# Altium project PC.PrjPCB
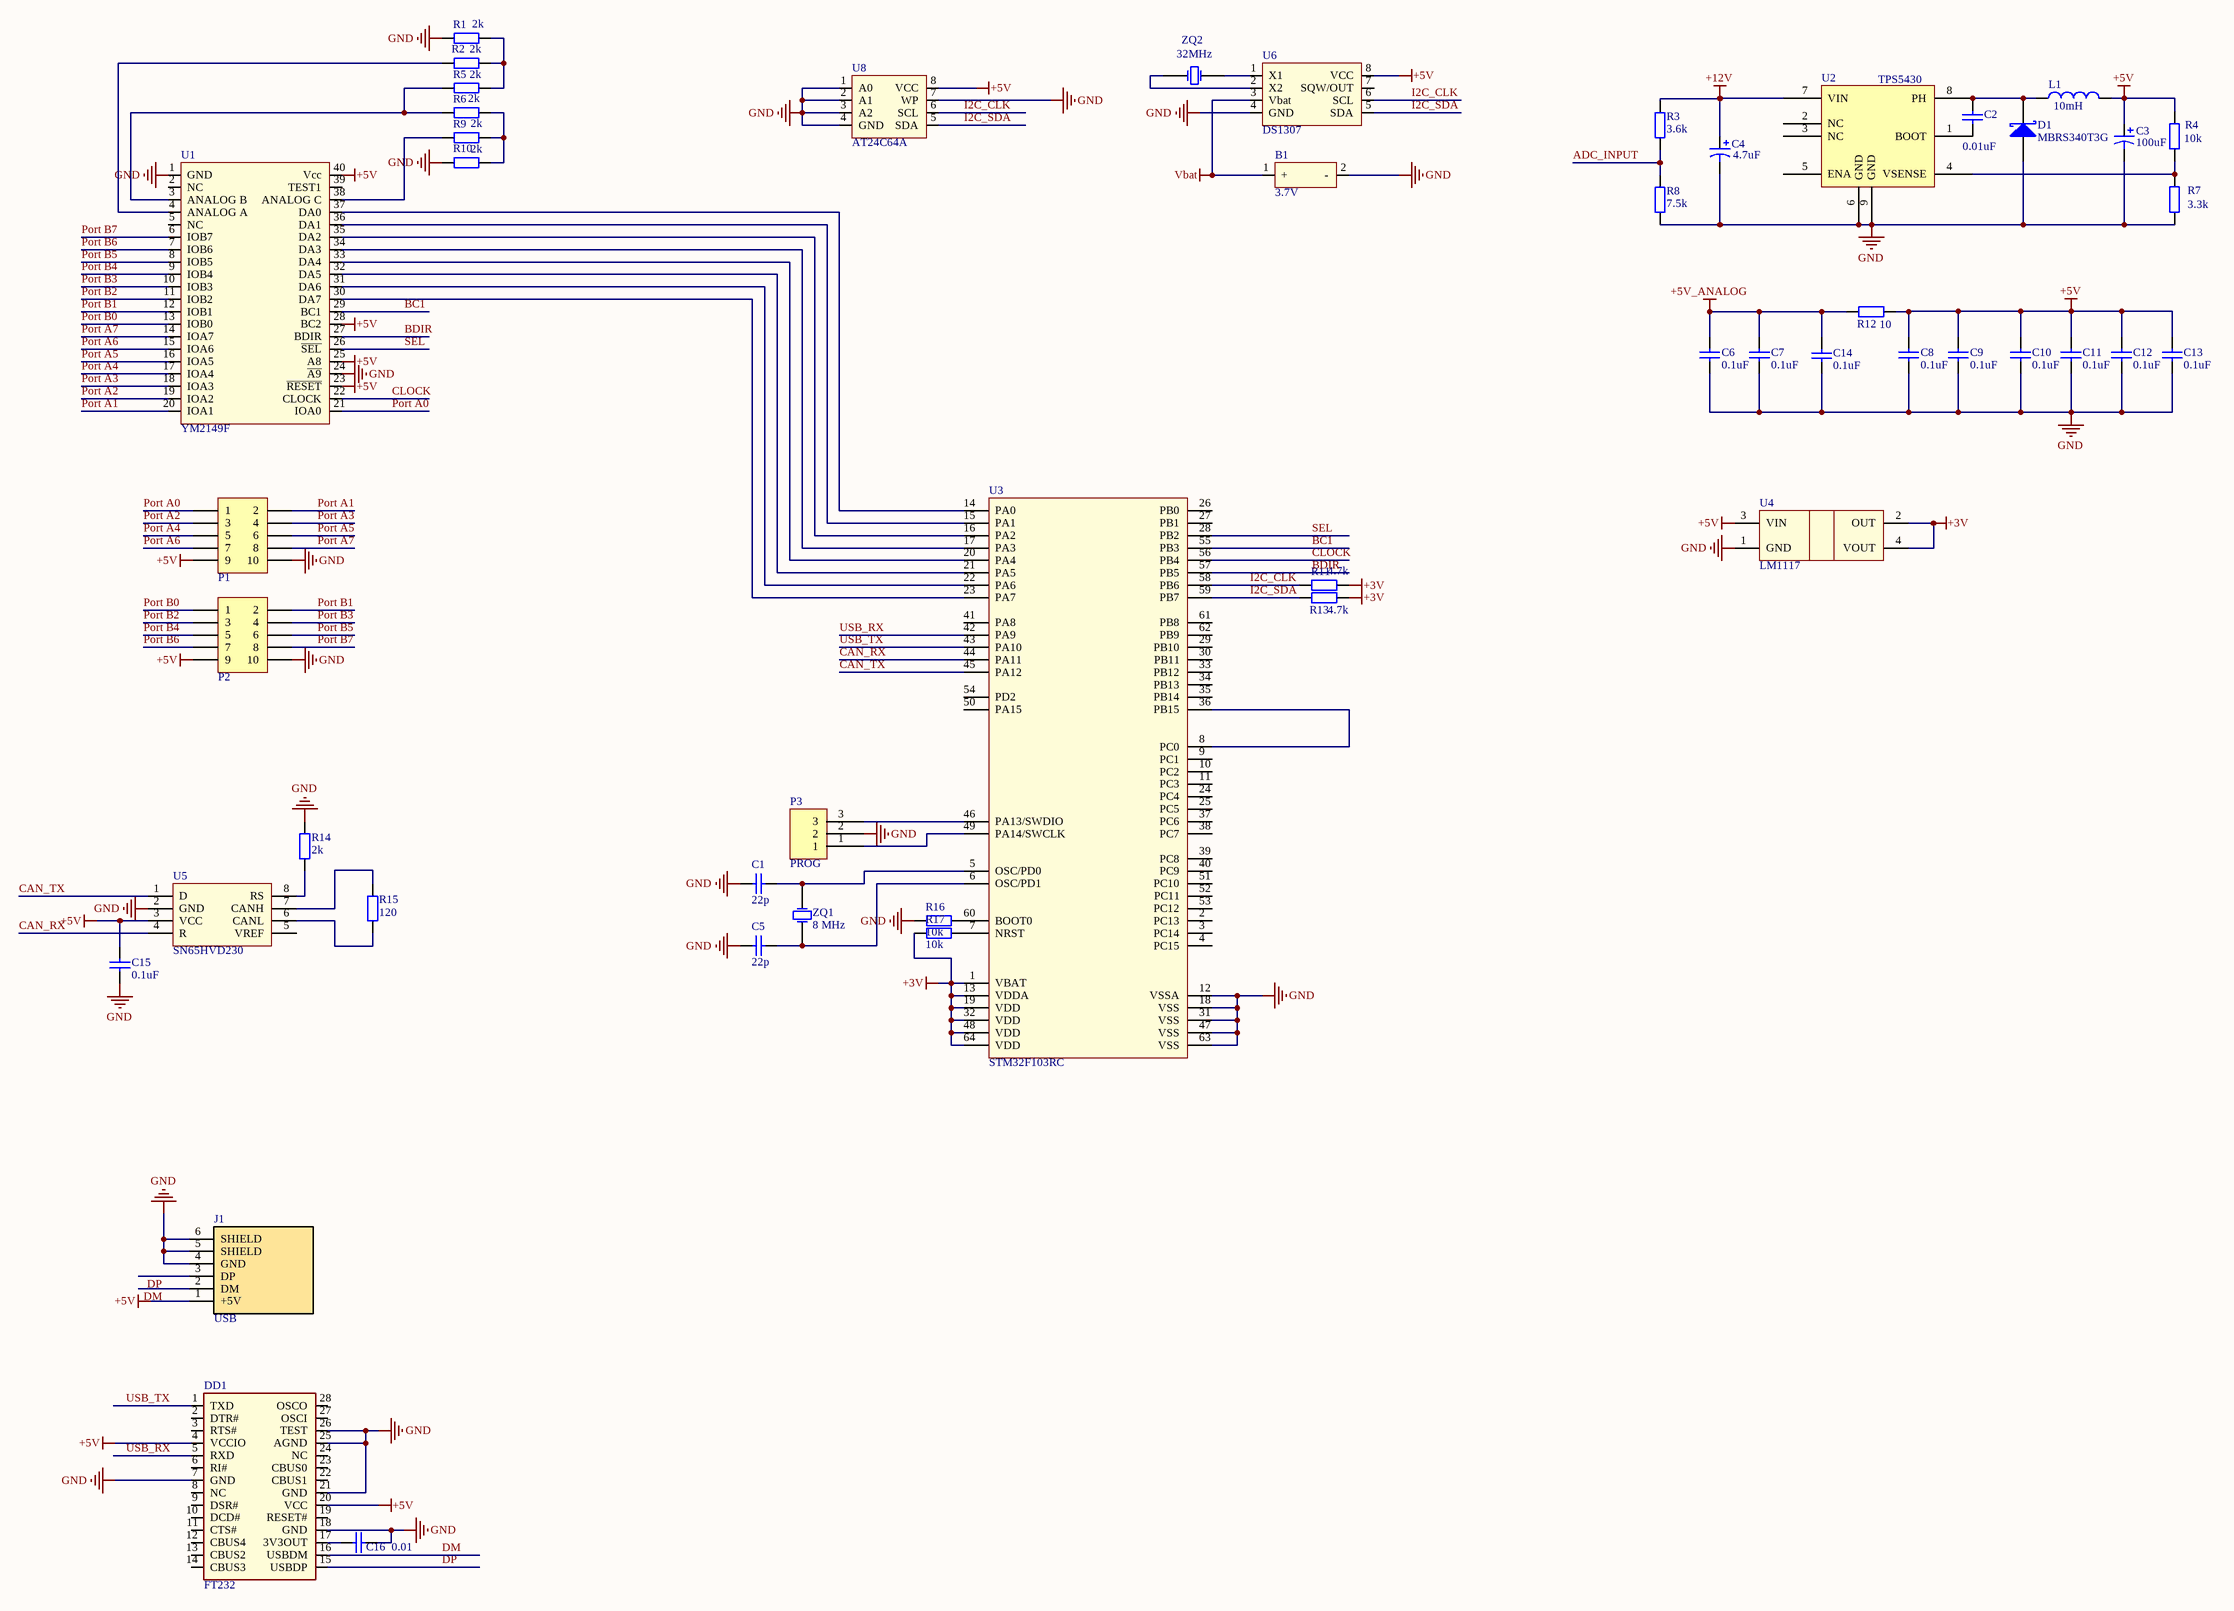
[diagram p0: PC.SchDoc]
1 sheet, 50 parts. Net scope: global (net labels, ports and power ports of the same name join across sheets).
Board file: PC.PcbDoc

## Sheet PC.SchDoc
size A2; PageSetup: Record=PageOptions|CenterHorizontal=True|CenterVertical=True|PrintScale=0.73|XCorrection=1.00|YCorrection=1.00|PrintKind=1|BorderSize=5000000|LeftOffset=0|BottomOffset=0|Orientation=1|PaperLength=1000|PaperWidth=1000|Scale=100|PaperSource=7|PrintQuality=-3|MediaType=1|DitherType=10|PrintScaleMode=1|PaperKind=A4|PaperIndex=9

### Parts
B1  3.7V  [Battery]
C1  value 22p  [Capacitor 0603]  (hidden comment: Capacitor)
C2  0.01uF  [CAP 0805]
C3  100uF  [Capacitor D case]
C4  4.7uF  [Capacitor D case]
C5  value 22p  [Capacitor 0603]  (hidden comment: Capacitor)
C6  0.1uF  [CAP 0805]
C7  0.1uF  [CAP 0805]
C8  0.1uF  [CAP 0805]
C9  0.1uF  [CAP 0805]
C10  0.1uF  [CAP 0805]
C11  0.1uF  [CAP 0805]
C12  0.1uF  [CAP 0805]
C13  0.1uF  [CAP 0805]
C14  0.1uF  [CAP 0805]
C15  value 0.1uF  [Capacitor 0603]  (hidden comment: Capacitor)
C16  0.01  [0805]
D1  MBRS340T3G  [SMC]
DD1  FT232  [SSOP28]
J1  USB  [USB2.5-2H4D - 2]
L1  value 10mH  [B82477]  (hidden comment: Inductor)
P1  Header 5X2  [HDR2X5]  (value not drawn)
P2  Header 5X2  [HDR2X5]  (value not drawn)
P3  PROG  [Header 3pin 2.54]
R1  2k  [RES 0603]
R2  2k  [RES 0603]
R3  3.6k  [RES 0805]
R4  10k  [RES 0805]
R5  2k  [RES 0603]
R6  2k  [RES 0603]
R7  3.3k  [RES 0805]
R8  7.5k  [RES 0805]
R9  2k  [RES 0603]
R10  2k  [RES 0603]
R11  4.7k  [RES 0603]
R12  10  [RES 0805]
R13  4.7k  [RES 0603]
R14  2k  [RES 0603]
R15  120  [RES 0603]
R16  10k  [RES 0603]
R17  10k  [RES 0603]
U1  YM2149F  [DIP40]
U2  TPS5430  [PSOP8]
U3  STM32F103RC  [LQFP64_L]
U4  LM1117  [SOT-223 - 2]
U5  SN65HVD230  [SO-8]
U6  DS1307  [SO-8]
U8  AT24C64A  [SO-8]
ZQ1  8 MHz  [QZ]
ZQ2  32MHz  [Quartz]

### Nets
+3V: R11.2 R13.2 R17.1 U3.1(VBAT) U3.13(VDDA) U3.19(VDD) U3.32(VDD) U3.48(VDD) U3.64(VDD) U4.2(OUT) U4.4(VOUT)
+5V: C3.1 C8.2 C9.2 C10.2 C11.2 C12.2 C13.2 C15.2 DD1.4(VCCIO) DD1.20(VCC) J1.1(+5V) L1.2 P1.9 P2.9 R4.2 R12.2 U1.23(~{RESET}) U1.25(A8) U1.28(BC2) U1.40(Vcc) U4.3(VIN) U5.3(VCC) U6.8(VCC) U8.8(VCC)
+5V_ANALOG: C6.2 C7.2 C14.1 R12.1
+12V: C4.1 R3.2 U2.7(VIN)
GND: B1.2(-) C1.1 C3.2 C4.2 C5.1 C6.1 C7.1 C8.1 C9.1 C10.1 C11.1 C12.1 C13.1 C14.2 C15.1 C16.1 D1.2(A) DD1.7(GND) DD1.18(GND) DD1.21(GND) DD1.25(AGND) DD1.26(TEST) J1.4(GND) J1.5(SHIELD) J1.6(SHIELD) P1.10 P2.10 P3.2 R1.1 R7.1 R8.1 R10.1 R14.2 R16.1 U1.1(GND) U1.24(~{A9}) U2.6(GND) U2.9(GND) U3.12(VSSA) U3.18(VSS) U3.31(VSS) U3.47(VSS) U3.63(VSS) U4.1(GND) U5.2(GND) U6.4(GND) U8.1(A0) U8.2(A1) U8.3(A2) U8.4(GND) U8.7(WP)
Vbat: B1.1(+) U6.3(Vbat)
ADC_INPUT: R3.1 R8.2
BC1: U1.29(BC1) U3.55(PB3)
BDIR: U1.27(BDIR) U3.57(PB5)
CAN_RX: U3.44(PA11) U5.4(R)
CAN_TX: U3.45(PA12) U5.1(D)
CLOCK: U1.22(CLOCK) U3.56(PB4)
DM: DD1.16(USBDM) J1.2(DM)
DP: DD1.15(USBDP) J1.3(DP)
I2C_CLK: R11.1 U3.58(PB6) U6.6(SCL) U8.6(SCL)
I2C_SDA: R13.1 U3.59(PB7) U6.5(SDA) U8.5(SDA)
Port A0: P1.1 U1.21(IOA0)
Port A1: P1.2 U1.20(IOA1)
Port A2: P1.3 U1.19(IOA2)
Port A3: P1.4 U1.18(IOA3)
Port A4: P1.5 U1.17(IOA4)
Port A5: P1.6 U1.16(IOA5)
Port A6: P1.7 U1.15(IOA6)
Port A7: P1.8 U1.14(IOA7)
Port B0: P2.1 U1.13(IOB0)
Port B1: P2.2 U1.12(IOB1)
Port B2: P2.3 U1.11(IOB2)
Port B3: P2.4 U1.10(IOB3)
Port B4: P2.5 U1.9(IOB4)
Port B5: P2.6 U1.8(IOB5)
Port B6: P2.7 U1.7(IOB6)
Port B7: P2.8 U1.6(IOB7)
SEL: U1.26(~{SEL}) U3.28(PB2)
USB_RX: DD1.5(RXD) U3.42(PA9)
USB_TX: DD1.1(TXD) U3.43(PA10)
NetC1_2: C1.2 U3.5(OSC/PD0) ZQ1.2(OSC2)
NetC2_1: C2.1 U2.1(BOOT)
NetC2_2: C2.2 D1.1(K) L1.1 U2.8(PH)
NetC5_2: C5.2 U3.6(OSC/PD1) ZQ1.1(OSC1)
NetC16_2: C16.2 DD1.17(3V3OUT)
NetP3_1: P3.1 U3.49(PA14/SWCLK)
NetP3_3: P3.3 U3.46(PA13/SWDIO)
NetR1_2: R1.2 R2.2 R5.2
NetR2_1: R2.1 U1.4(ANALOG_A)
NetR4_1: R4.1 R7.2 U2.4(VSENSE)
NetR5_1: R5.1 R6.1 U1.3(ANALOG_B)
NetR6_2: R6.2 R9.2 R10.2
NetR9_1: R9.1 U1.38(ANALOG_C)
NetR14_1: R14.1 U5.8(RS)
NetR15_1: R15.1 U5.6(CANL)
NetR15_2: R15.2 U5.7(CANH)
NetR16_2: R16.2 U3.60(BOOT0)
NetR17_2: R17.2 U3.7(NRST)
NetU1_30: U1.30(DA7) U3.23(PA7)
NetU1_31: U1.31(DA6) U3.22(PA6)
NetU1_32: U1.32(DA5) U3.21(PA5)
NetU1_33: U1.33(DA4) U3.20(PA4)
NetU1_34: U1.34(DA3) U3.17(PA3)
NetU1_35: U1.35(DA2) U3.16(PA2)
NetU1_36: U1.36(DA1) U3.15(PA1)
NetU1_37: U1.37(DA0) U3.14(PA0)
NetU3_8: U3.8(PC0) U3.36(PB15)
NetU6_1: U6.1(X1) ZQ2.1(OSC1)
NetU6_2: U6.2(X2) ZQ2.2(OSC2)

Not connected (* = marked no-connect by the designer): DD1 2(DTR#) 3(RTS#) 6(RI#) 8(NC) 9(DSR#) 10(DCD#) 11(CTS#) 12(CBUS4) 13(CBUS2) 14(CBUS3) 19(RESET#) 22(CBUS1) 23(CBUS0) 24(NC) 27(OSCI) 28(OSCO); U1 2(NC) 5(NC) 39(TEST1); U2 2(NC) 3(NC) 5(ENA); U3 2(PC13) 3(PC14) 4(PC15) 9(PC1) 10(PC2) 11(PC3) 24(PC4) 25(PC5) 26(PB0) 27(PB1) 29(PB10) 30(PB11) 33(PB12) 34(PB13) 35(PB14) 37(PC6) 38(PC7) 39(PC8) 40(PC9) 41(PA8) 50(PA15) 51(PC10) 52(PC11) 53(PC12) 54(PD2) 61(PB8) 62(PB9); U5 5(VREF); U6 7(SQW/OUT)

### Library data of the parts
B1 = Battery
C2 C6-C14 C16 = Capacitor
  C2: Value: 0.01uF
  C6-C14: Value: 0.1uF
  C16: Value: 0.01
C3 C4 = Cap Pol: Polarized Capacitor (Axial); Published: 8-Jun-2000; LatestRevisionDate: 17-Jul-2002; LatestRevisionNote: Re-released for DXP Platform.; PackageReference: POLAR0.8; Publisher: Altium Limited; PackageDescription: Polarized Capacitor; 2 Leads
  C3: Value: 100uF
  C4: Value: 4.7uF
D1 = Diode schottky: Schottky Rectifier; Note: Terminal 2 is the TAB and is electrically connected to the cathode; Published: 8-Jun-2000; LatestRevisionDate: 17-Jul-2002; LatestRevisionNote: Re-released for DXP Platform.; DatasheetVersion: Dec-1997; PackageVersion: Feb-1998; PackageReference: TO-220AC; Publisher: Altium Limited; PackageDescription: TO, Thru-Hole, Vertical, Heatsink Mounted; 3 In-Line Leads (1 Absent); Pitch 2.54 mm; ComponentLink1Description: Manufacturer Link; ComponentLink1URL: http://www.irf.com/; ComponentLink2Description: Datasheet; ComponentLink2URL: http://www.irf.com/product-info/datasheets/data/18tq.pdf
L1 = Inductor: Code_IEC: 1005; Published: 8-Jun-2000; LatestRevisionDate: 29-May-2009; LatestRevisionNote: IPC-7351 Footprint Added.; PackageReference: 0402-A; Publisher: Altium Limited; PackageDescription: Chip Inductor; Code_JEITA: 0402
P1 P2 = Header 5X2: Header, 5-Pin, Dual row; LatestRevisionDate: 17-Jul-2002; LatestRevisionNote: Re-released for DXP Platform.; Publisher: Altium Limited
P3 = Header1x3
R1-R17 = Resistor
  R1 R2 R5 R6 R9 R10 R14: Value: 2k
  R3: Value: 3.6k
  R4 R16 R17: Value: 10k
  R7: Value: 3.3k
  R8: Value: 7.5k
  R11 R13: Value: 4.7k
  R12: Value: 10
  R15: Value: 120
U4 = LM1117: Linear regulator
U5 = SN65HVD230: CAN PHY
ZQ1 ZQ2 = QZ